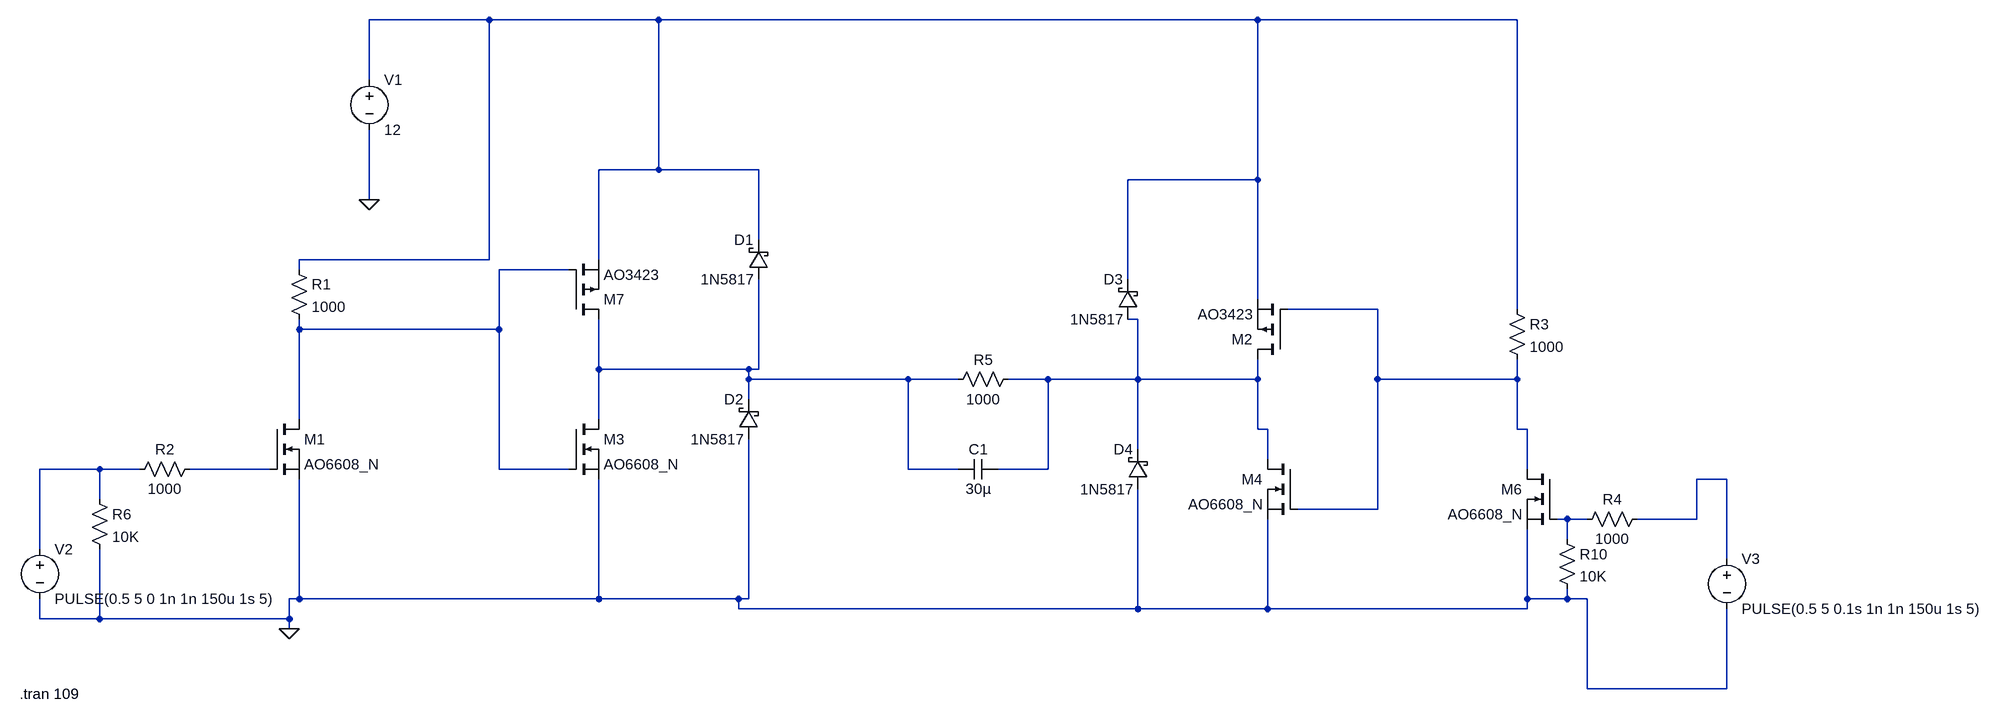
[diagram p0: schematic SusanShoreHbridge.asc]
SusanShoreHbridge.asc, the LTspice schematic file:
Version 4.1
SHEET 1 2852 680
WIRE 416 -528 224 -528
WIRE 688 -528 416 -528
WIRE 1648 -528 688 -528
WIRE 2064 -528 1648 -528
WIRE 224 -432 224 -528
WIRE 688 -288 688 -528
WIRE 688 -288 592 -288
WIRE 848 -288 688 -288
WIRE 1648 -272 1648 -528
WIRE 1648 -272 1440 -272
WIRE 224 -240 224 -352
WIRE 848 -176 848 -288
WIRE 416 -144 416 -528
WIRE 416 -144 112 -144
WIRE 592 -144 592 -288
WIRE 112 -128 112 -144
WIRE 544 -128 432 -128
WIRE 1440 -112 1440 -272
WIRE 1648 -80 1648 -272
WIRE 1840 -64 1696 -64
WIRE 2064 -64 2064 -528
WIRE 1456 -48 1440 -48
WIRE 112 -32 112 -48
WIRE 432 -32 432 -128
WIRE 432 -32 112 -32
WIRE 592 32 592 -48
WIRE 832 32 592 32
WIRE 848 32 848 -112
WIRE 848 32 832 32
WIRE 832 48 832 32
WIRE 1088 48 832 48
WIRE 1168 48 1088 48
WIRE 1312 48 1248 48
WIRE 1456 48 1456 -48
WIRE 1456 48 1312 48
WIRE 1648 48 1648 16
WIRE 1648 48 1456 48
WIRE 1840 48 1840 -64
WIRE 2064 48 2064 16
WIRE 2064 48 1840 48
WIRE 832 80 832 48
WIRE 112 112 112 -32
WIRE 592 112 592 32
WIRE 1648 128 1648 48
WIRE 1664 128 1648 128
WIRE 2064 128 2064 48
WIRE 2080 128 2064 128
WIRE 1456 160 1456 48
WIRE 1664 176 1664 128
WIRE -208 192 -304 192
WIRE -144 192 -208 192
WIRE 64 192 -64 192
WIRE 432 192 432 -32
WIRE 544 192 432 192
WIRE 1088 192 1088 48
WIRE 1168 192 1088 192
WIRE 1312 192 1312 48
WIRE 1312 192 1232 192
WIRE 2080 192 2080 128
WIRE 2400 208 2352 208
WIRE -208 240 -208 192
WIRE 1840 256 1840 48
WIRE 1840 256 1712 256
WIRE 2144 272 2128 272
WIRE 2176 272 2144 272
WIRE 2352 272 2352 208
WIRE 2352 272 2256 272
WIRE 2144 304 2144 272
WIRE -304 320 -304 192
WIRE 2400 336 2400 208
WIRE 112 400 112 208
WIRE 112 400 96 400
WIRE 592 400 592 208
WIRE 592 400 112 400
WIRE 816 400 592 400
WIRE 832 400 832 144
WIRE 832 400 816 400
WIRE 2080 400 2080 288
WIRE 2144 400 2144 384
WIRE 2144 400 2080 400
WIRE 2176 400 2144 400
WIRE 816 416 816 400
WIRE 1456 416 1456 224
WIRE 1456 416 816 416
WIRE 1664 416 1664 272
WIRE 1664 416 1456 416
WIRE 2080 416 2080 400
WIRE 2080 416 1664 416
WIRE -304 432 -304 400
WIRE -208 432 -208 320
WIRE -208 432 -304 432
WIRE 96 432 96 400
WIRE 96 432 -208 432
WIRE 96 448 96 432
WIRE 2176 544 2176 400
WIRE 2400 544 2400 416
WIRE 2400 544 2176 544
FLAG 96 448 0
FLAG 224 -240 0
SYMBOL nmos 64 112 R0
SYMATTR InstName M1
SYMATTR Value AO6608_N
SYMBOL res 96 -144 R0
SYMATTR InstName R1
SYMATTR Value 1000
SYMBOL nmos 544 112 R0
SYMATTR InstName M3
SYMATTR Value AO6608_N
SYMBOL nmos 1712 176 M0
SYMATTR InstName M4
SYMATTR Value AO6608_N
SYMBOL nmos 2128 192 M0
SYMATTR InstName M6
SYMATTR Value AO6608_N
SYMBOL res 2048 -80 R0
SYMATTR InstName R3
SYMATTR Value 1000
SYMBOL schottky 864 -112 R180
WINDOW 0 24 64 Left 2
WINDOW 3 24 0 Left 2
SYMATTR InstName D1
SYMATTR Value 1N5817
SYMATTR Description Diode
SYMATTR Type diode
SYMBOL schottky 848 144 R180
WINDOW 0 24 64 Left 2
WINDOW 3 24 0 Left 2
SYMATTR InstName D2
SYMATTR Value 1N5817
SYMATTR Description Diode
SYMATTR Type diode
SYMBOL schottky 1456 -48 R180
WINDOW 0 24 64 Left 2
WINDOW 3 24 0 Left 2
SYMATTR InstName D3
SYMATTR Value 1N5817
SYMATTR Description Diode
SYMATTR Type diode
SYMBOL schottky 1472 224 R180
WINDOW 0 24 64 Left 2
WINDOW 3 24 0 Left 2
SYMATTR InstName D4
SYMATTR Value 1N5817
SYMATTR Description Diode
SYMATTR Type diode
SYMBOL voltage 224 -448 R0
WINDOW 123 0 0 Left 0
WINDOW 39 0 0 Left 0
SYMATTR InstName V1
SYMATTR Value 12
SYMBOL res 1264 32 R90
WINDOW 0 0 56 VBottom 2
WINDOW 3 32 56 VTop 2
SYMATTR InstName R5
SYMATTR Value 1000
SYMBOL voltage -304 304 R0
WINDOW 123 0 0 Left 0
WINDOW 39 0 0 Left 0
SYMATTR InstName V2
SYMATTR Value PULSE(0.5 5 0 1n 1n 150u 1s 5)
SYMBOL voltage 2400 320 R0
WINDOW 123 0 0 Left 0
WINDOW 39 0 0 Left 0
SYMATTR InstName V3
SYMATTR Value PULSE(0.5 5 0.1s 1n 1n 150u 1s 5)
SYMBOL pmos 544 -48 M180
SYMATTR InstName M7
SYMATTR Value AO3423
SYMBOL pmos 1696 16 R180
SYMATTR InstName M2
SYMATTR Value AO3423
SYMBOL cap 1168 208 R270
WINDOW 0 32 32 VTop 2
WINDOW 3 0 32 VBottom 2
SYMATTR InstName C1
SYMATTR Value 30µ
SYMBOL res -48 176 R90
WINDOW 0 0 56 VBottom 2
WINDOW 3 32 56 VTop 2
SYMATTR InstName R2
SYMATTR Value 1000
SYMBOL res 2272 256 R90
WINDOW 0 0 56 VBottom 2
WINDOW 3 32 56 VTop 2
SYMATTR InstName R4
SYMATTR Value 1000
SYMBOL res -224 224 R0
SYMATTR InstName R6
SYMATTR Value 10K
SYMBOL res 2128 288 R0
SYMATTR InstName R10
SYMATTR Value 10K
TEXT -336 552 Left 2 !.tran 109

The netlist it stands for:
* SusanShoreHbridge.asc
M1 N002 N007 0 0 AO6608_N
R1 N001 N002 1000
M3 N005 N002 0 0 AO6608_N
M4 N004 N003 0 0 AO6608_N
M6 N003 N009 0 0 AO6608_N
R3 N001 N003 1000
D1 N005 N001 1N5817
D2 0 N005 1N5817
D3 N004 N001 1N5817
D4 0 N004 1N5817
V1 N001 0 12
R5 N004 N005 1000
V2 N006 0 PULSE(0.5 5 0 1n 1n 150u 1s 5)
V3 N008 0 PULSE(0.5 5 0.1s 1n 1n 150u 1s 5)
M7 N005 N002 N001 N001 AO3423
M2 N004 N003 N001 N001 AO3423
C1 N005 N004 30µ
R2 N007 N006 1000
R4 N008 N009 1000
R6 N006 0 10K
R10 N009 0 10K
.model D D
.lib standard.dio
.model NMOS NMOS
.model PMOS PMOS
.lib standard.mos
.tran 109
.backanno
.end